# Altium schematic sheet [06] - MICRO CONTROLLER CONNECTORS.SchDoc (part 2 of 2)
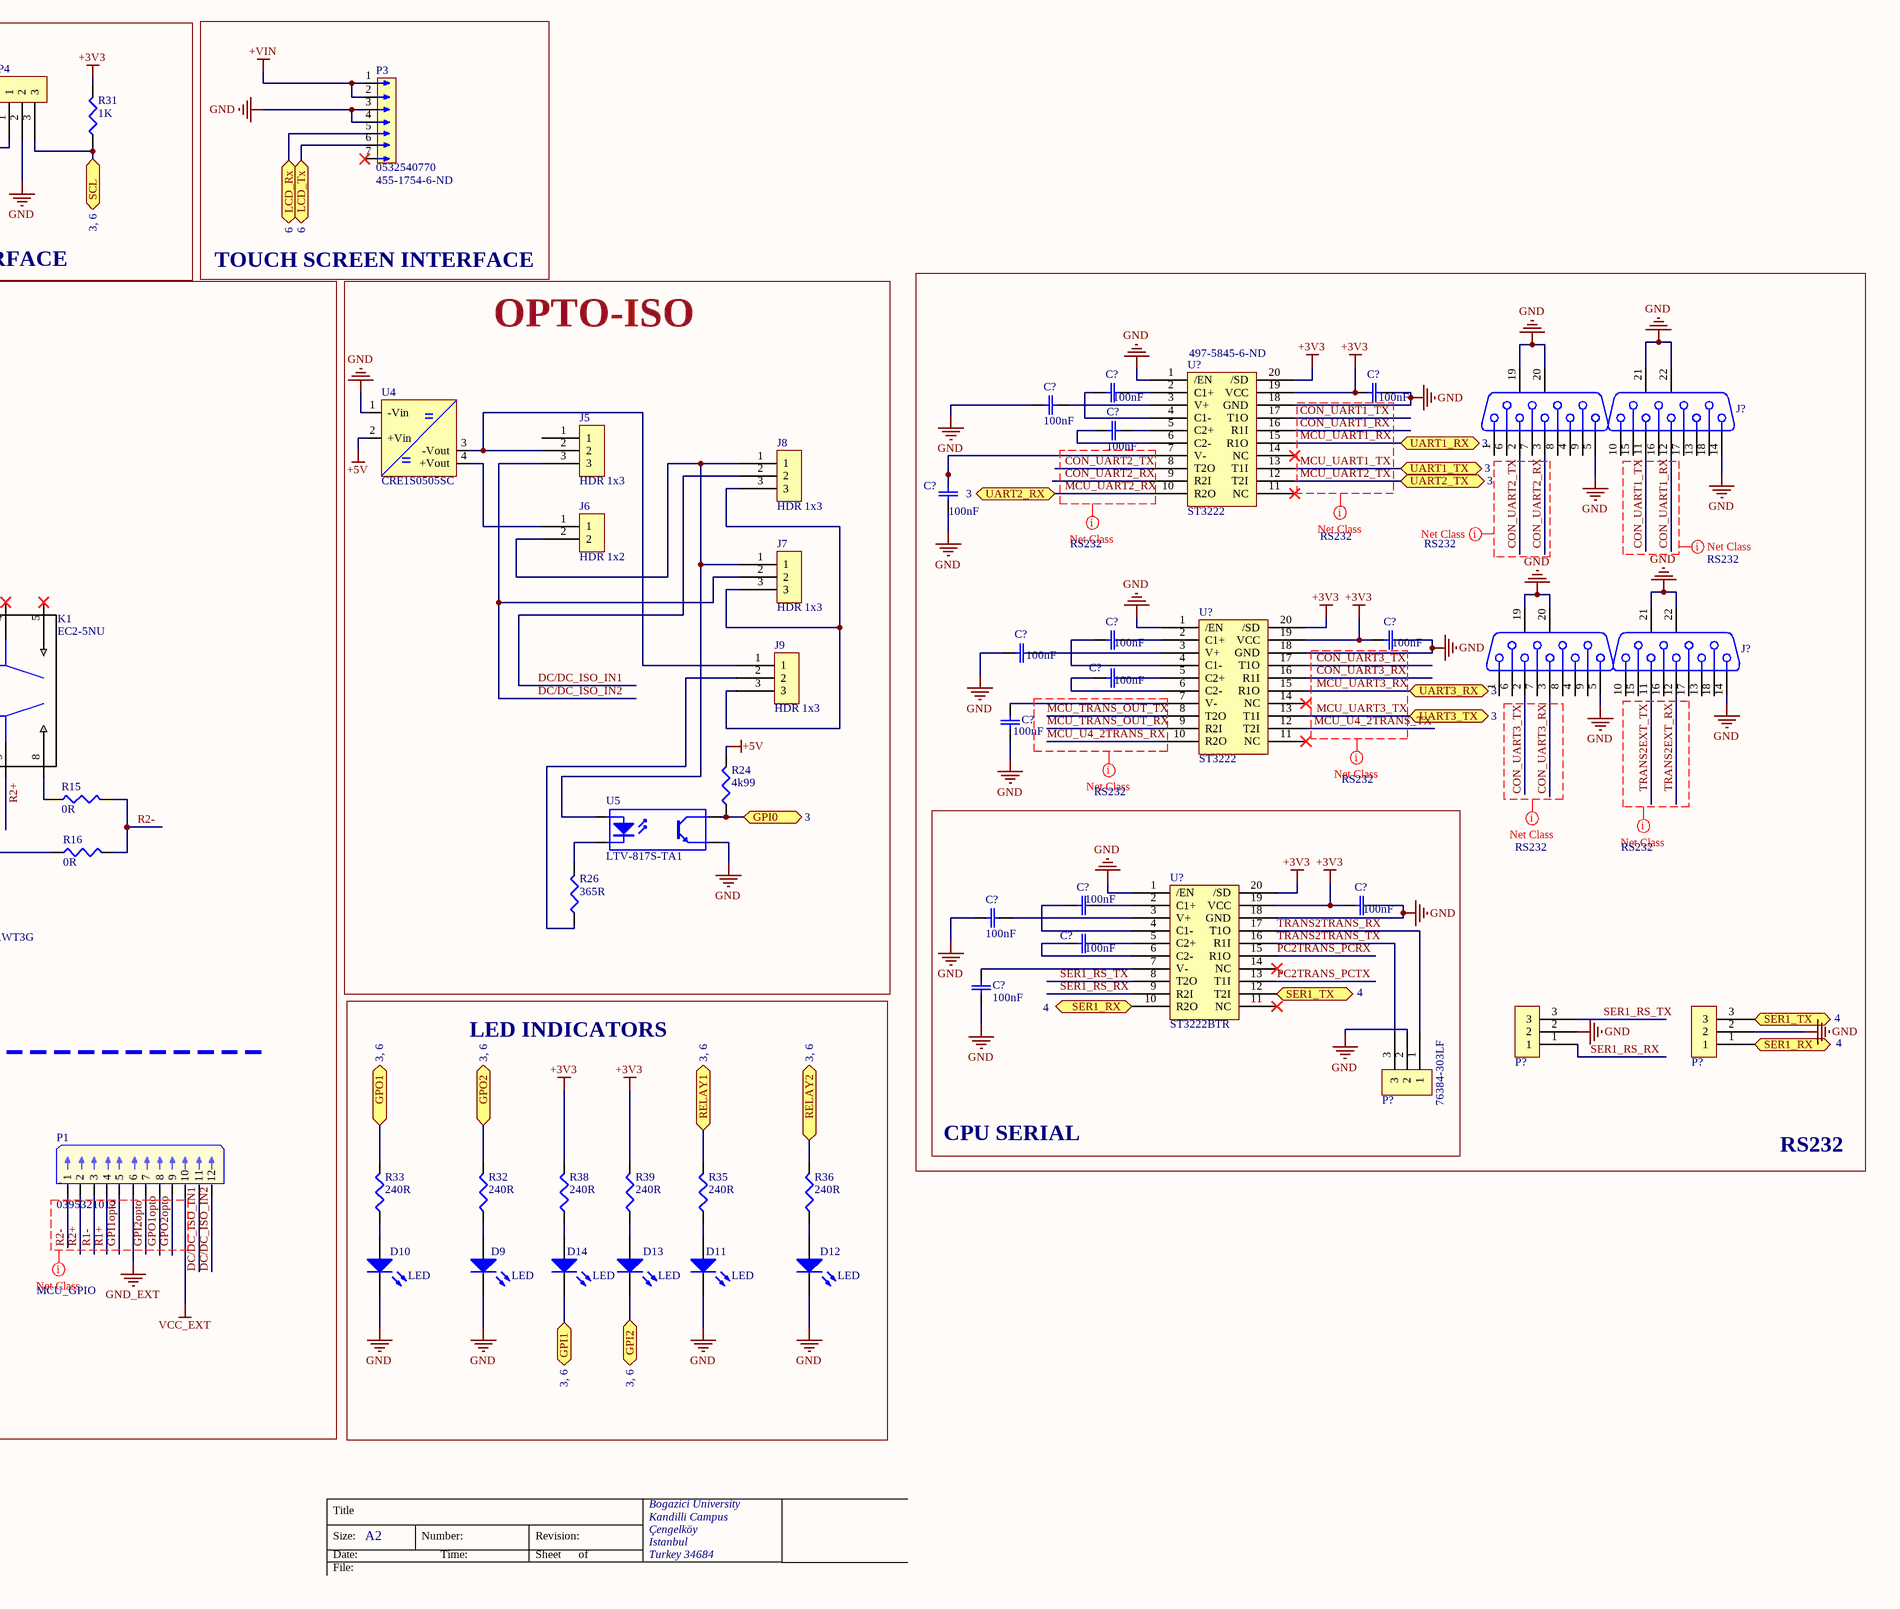
[diagram p4: [06] - MICRO CONTROLLER CONNECTORS.SchDoc, bottom right]

## Library data of the parts
C1 C5 C?#1-C?#4 = CL05A104KA5NNNC: CAP CER 0.1UF 50V X8R 0603; Manufacturer 1: Samsung Electro-Mechanics; Tolerance: ±10%; Voltage - Rated: 25V; Temperature Coefficient: X5R; Notification: Current market demand for these product types have resulted in fluctuating and extending lead times. Lead times may differ.; Description 1: CAP CER 0.1UF 25V X5R 0402; Manufacturer Part Number 1: CL05A104KA5NNNC; RoHS: RoHS Compliant; Stock 1: 100000; Pricing 1: 1=0.1, 10=0.04, 100=0.0176, 500=0.0126, 1000=0.0099, 2500=0.009, 5000=0.00828 (USD); Packaging: Digi-Reel®; Part Status: Active; Operating Temperature: -55°C ~ 85°C; Features: -; Ratings: -; Applications: General Purpose; Mounting Type: Surface Mount, MLCC; Package / Case: 0402 (1005 Metric); Size / Dimension: 0.039" L x 0.020" W (1.00mm x 0.50mm); Height - Seated (Max): -; Thickness (Max): 0.022" (0.55mm); Lead Spacing: -; Lead Style: -; Supplier 1: Digi-Key; Supplier Part Number 1: 1276-1043-6-ND; Category: Capacitors; ComponentLink1URL: http://www.samsungsem.com/kr/support/product-search/mlcc/CL05A104KA5NNNC.jsp; ComponentLink1Description: http://www.samsungsem.com/kr/support/product-search/mlcc/CL05A104KA5NNNC.jsp
C57 C66 C?#5-C?#15 = CL05A104KA5NNNC: CAP CER 0.1UF 50V X8R 0603; Manufacturer 1: Samsung Electro-Mechanics; Voltage - Rated: 25V; Tolerance: ±10%; Temperature Coefficient: X5R; Notification: Current market demand for these product types have resulted in fluctuating and extending lead times. Lead times may differ.; Description 1: CAP CER 0.1UF 25V X5R 0402; Category: Capacitors; Operating Temperature: -55°C ~ 85°C; Package / Case: 0402 (1005 Metric); Supplier 1: Digi-Key; Supplier Part Number 1: 1276-1043-6-ND; RoHS: RoHS Compliant; Stock 1: 100000; Pricing 1: 1=0.1, 10=0.04, 100=0.0176, 500=0.0126, 1000=0.0099, 2500=0.009, 5000=0.00828 (USD); Mounting Type: Surface Mount, MLCC; Applications: General Purpose; Ratings: -; Size / Dimension: 0.039" L x 0.020" W (1.00mm x 0.50mm); Height - Seated (Max): -; Thickness (Max): 0.022" (0.55mm); Lead Spacing: -; Features: -; Packaging: Digi-Reel®; Lead Style: -; ComponentLink1URL: http://www.samsungsem.com/kr/support/product-search/mlcc/CL05A104KA5NNNC.jsp; ComponentLink1Description: http://www.samsungsem.com/kr/support/product-search/mlcc/CL05A104KA5NNNC.jsp; Manufacturer Part Number 1: CL05A104KA5NNNC; Part Status: Active
C63 = CGA5L3X8R1H105K1: CAP CER 1UF 50V X8R 1206; Manufacturer_Part_Number: CGA5L3X8R1H105K160AB; Manufacturer 1: TDK Corporation; Vendor: TDK; Built_By: EMA_UL_Team; Type: DEV; C: Copyright (C) 2015 Accelerated Designs. All rights reserved; Tolerance: ±10%; RefDes: RefDes; Value: Value; Manufacturer Part Number 1: CGA5L3X8R1H105K160AB; RoHS: RoHS Compliant; Stock 1: 3285; Pricing 1: 1=0.85, 10=0.628, 100=0.4306, 500=0.34086, 1000=0.28704 (USD); Packaging: Cut Tape (CT); Part Status: Active; Voltage - Rated: 50V; Temperature Coefficient: X8R; Operating Temperature: -55°C ~ 150°C; Features: High Temperature; Ratings: AEC-Q200; Applications: Automotive; Failure Rate: -; Mounting Type: Surface Mount, MLCC; Package / Case: 1206 (3216 Metric); Size / Dimension: 0.126" L x 0.063" W (3.20mm x 1.60mm); Height - Seated (Max): -; Thickness (Max): 0.071" (1.80mm); Lead Spacing: -; Lead Style: -; ComponentLink1URL: https://product.tdk.com/info/en/catalog/datasheets/mlcc_automotive_hightemp_en.pdf; ComponentLink1Description: https://product.tdk.com/info/en/catalog/datasheets/mlcc_automotive_hightemp_en.pdf; Supplier 1: Digi-Key; Supplier Part Number 1: 445-13000-1-ND; Description 1: CAP CER 1UF 50V X8R 1206; Category: Capacitors
D3 D4 D28 = CDSOT23: TVS DIODE 24V 40V SOT23; Manufacturer 1: Bourns Inc.; Manufacturer Part Number 1: CDSOT23-T24CAN; Type: Zener; Voltage - Breakdown (Min): 26.2V; Current - Peak Pulse (10/1000µs): 8A (8/20µs); Power Line Protection: No; Capacitance @ Frequency: 22pF @ 1MHz; RoHS: RoHS Compliant; Stock 1: 26793; Pricing 1: 1=0.57, 10=0.399, 25=0.3272, 100=0.2617, 250=0.19036, 500=0.15466, 1000=0.11897 (USD); Packaging: Cut Tape (CT); Part Status: Active; Voltage - Reverse Standoff (Typ): 24V; Voltage - Clamping (Max) @ Ipp: 40V; Power - Peak Pulse: -; Applications: CAN; Operating Temperature: -40°C ~ 150°C (TJ); Mounting Type: Surface Mount; Package / Case: TO-236-3, SC-59, SOT-23-3; Supplier Device Package: SOT-23; ComponentLink1URL: https://www.bourns.com/docs/Product-Datasheets/CDSOT23-T24CAN.pdf; ComponentLink1Description: https://www.bourns.com/docs/Product-Datasheets/CDSOT23-T24CAN.pdf; Supplier 1: Digi-Key; Supplier Part Number 1: CDSOT23-T24CANCT-ND; Description 1: TVS DIODE 24V 40V SOT23; Category: Circuit Protection
D6 D7 = 1N4148: DIODE GEN PURP 100V 150MA SOD123; Manufacturer 1: Micro Commercial Co; Manufacturer Part Number 1: 1N4148W-TP; Vendor: Nexperia; Type: DEV; C: Copyright (C) 2015 Accelerated Designs. All rights reserved; .Checked PCB: CHK; Diode Type: Standard; Speed: Small Signal =< 200mA (Io), Any Speed; Capacitance @ Vr, F: 2pF @ 0V, 1MHz; Manufacturer_Part_Number: 1N4148; Copyright: Copyright (C) 2016 Accelerated Designs. All rights reserved; RefDes: RefDes; Value: Value; .Checked SCH: CHK; Supplier 1: Digi-Key; Supplier Part Number 1: 1N4148WTPMSCT-ND; RoHS: RoHS Compliant; Description 1: DIODE GEN PURP 100V 150MA SOD123; Category: Discrete Semiconductor Products; Stock 1: 1984430; Pricing 1: 1=0.14, 10=0.131, 100=0.0856, 500=0.04186, 1000=0.02854 (USD); Packaging: Cut Tape (CT); Part Status: Active; Current - Average Rectified (Io): 150mA; Mounting Type: Surface Mount; Package / Case: SOD-123; Supplier Device Package: SOD-123; Operating Temperature - Junction: -65°C ~ 150°C; Base Part Number: 1N4148W; ComponentLink1URL: http://www.mccsemi.com/up_pdf/1N4148W(SOD123).pdf; ComponentLink1Description: http://www.mccsemi.com/up_pdf/1N4148W(SOD123).pdf
D9-D12 D14 = LW Q38E-Q1OO-3K6L-1: LED COOL WHITE DIFFUSED 0603 SMD; Manufacturer 1: OSRAM Opto Semiconductors Inc.; Color: White, Cool; Lens Color: Yellow; Millicandela Rating: 81mcd; Lens Style/Size: Rectangle with Flat Top, 1.10mm x 0.80mm; Voltage - Forward (Vf) (Typ): 2.85V; Current - Test: 5mA; Viewing Angle: 150°, 130°; Wavelength - Dominant: 8200K; Supplier 1: Digi-Key; Supplier Part Number 1: 475-2831-1-ND; Manufacturer Part Number 1: LW Q38E-Q1OO-3K6L-1; RoHS: RoHS Compliant; Description 1: LED COOL WHITE DIFFUSED 0603 SMD; Category: Optoelectronics; Stock 1: 215520; Pricing 1: 1=0.49, 10=0.354, 25=0.2888, 100=0.231, 250=0.19492, 500=0.16604, 1000=0.12994 (USD); Packaging: Cut Tape (CT); Part Status: Active; Lens Transparency: Diffused; Mounting Type: Surface Mount; Wavelength - Peak: -; Features: -; Package / Case: 0603 (1608 Metric); Supplier Device Package: 0603; Size / Dimension: 1.60mm L x 0.80mm W; Height (Max): 0.40mm; ComponentLink1URL: https://dammedia.osram.info/media/resource/hires/osram-dam-2493068/LW%20Q38E.pdf; ComponentLink1Description: https://dammedia.osram.info/media/resource/hires/osram-dam-2493068/LW%20Q38E.pdf
D13 = LS Q976-NR-1: LED RED DIFFUSED 0603 SMD; Manufacturer 1: OSRAM Opto Semiconductors Inc.; Lens Color: White; Millicandela Rating: 104mcd; Lens Style/Size: Rectangle with Flat Top, 1.00mm x 0.80mm; Voltage - Forward (Vf) (Typ): 2V; Current - Test: 20mA; Viewing Angle: 160°; Wavelength - Dominant: 633nm; Wavelength - Peak: 645nm; Supplier 1: Digi-Key; Supplier Part Number 1: 475-2512-1-ND; Manufacturer Part Number 1: LS Q976-NR-1; RoHS: RoHS Compliant; Description 1: LED RED DIFFUSED 0603 SMD; Category: Optoelectronics; Stock 1: 127302; Pricing 1: 1=0.38, 10=0.274, 25=0.202, 100=0.1444, 250=0.0982, 500=0.08664, 1000=0.06787 (USD); Packaging: Cut Tape (CT); Part Status: Active; Color: Red; Lens Transparency: Diffused; Mounting Type: Surface Mount; Features: -; Package / Case: 0603 (1608 Metric); Supplier Device Package: 0603; Size / Dimension: 1.60mm L x 0.80mm W; Height (Max): 0.80mm; ComponentLink1URL: https://dammedia.osram.info/media/resource/hires/osram-dam-2493499/LS%20Q976.pdf; ComponentLink1Description: https://dammedia.osram.info/media/resource/hires/osram-dam-2493499/LS%20Q976.pdf; Published: 8-Jun-2000; LatestRevisionDate: 08-Jul-2005; LatestRevisionNote: Mech Layer 1 removed.; PackageReference: LED-0; Publisher: Altium Limited; PackageDescription: LED; 2 Leads
D27 = BAT43WS-7-F: DIODE SCHOTTKY 30V 200MA SOD323; Manufacturer 1: Diodes Incorporated; Current - Average Rectified (Io): 200mA (DC); Speed: Small Signal =< 200mA (Io), Any Speed; Capacitance @ Vr, F: 10pF @ 1V, 1MHz; Manufacturer Part Number 1: BAT43WS-7-F; RoHS: RoHS Compliant; Stock 1: 45041; Pricing 1: 1=0.47, 10=0.352, 100=0.2028, 500=0.13698, 1000=0.10685 (USD); Packaging: Cut Tape (CT); Part Status: Active; Diode Type: Schottky; Mounting Type: Surface Mount; Package / Case: SC-76, SOD-323; Supplier Device Package: SOD-323; Operating Temperature - Junction: -55°C ~ 125°C; Base Part Number: BAT43WS; ComponentLink1URL: https://www.diodes.com/assets/Datasheets/ds30100.pdf; ComponentLink1Description: https://www.diodes.com/assets/Datasheets/ds30100.pdf; Supplier 1: Digi-Key; Supplier Part Number 1: BAT43WS-FDICT-ND; Description 1: DIODE SCHOTTKY 30V 200MA SOD323; Category: Discrete Semiconductor Products
J2 = 796644-3: TERM BLOCK HDR 3POS 90DEG 5MM; Manufacturer 1: TE Connectivity AMP Connectors; Vendor: TE Connectivity; Built_By: EMA_UL_Team; C: Copyright (C) 2015 Accelerated Designs. All rights reserved; Number of Positions: 3; Number of Levels: 1; Pitch: 0.197" (5.00mm); Header Orientation: 90°, Right Angle; Material Flammability Rating: UL94 V-0; Contact Tail Length: 0.138" (3.50mm); .Checked PCB: CHK; Manufacturer_Part_Number: 796644-3; RefDes: RefDes; Type: DEV; Value: Value; Manufacturer Part Number 1: 796644-3; RoHS: RoHS Compliant; Stock 1: 93322; Pricing 1: 1=1.05, 10=0.734, 25=0.6848, 50=0.6218, 100=0.619, 250=0.52268, 500=0.49516, 1000=0.44014, 5000=0.35762 (USD); Packaging: Bulk; Part Status: Active; Positions Per Level: 3; Plug Wire Entry: -; Termination Style: Solder; Mounting Type: Through Hole; Current - IEC: -; Wire Gauge or Range - AWG: -; Wire Gauge or Range - mm²: -; Color: Green; Operating Temperature: -40°C ~ 110°C; Contact Mating Finish: Tin; Features: -; Ingress Protection: -; Screw Size: -; Torque - Screw: -; Wire Strip Length: -; Contact Material: Copper Alloy; Housing Material: Polyamide (PA66), Nylon 6/6; Insulation Height: 0.329" (8.36mm); ComponentLink1URL: http://www.te.com/commerce/DocumentDelivery/DDEController?Action=srchrtrv&DocNm=796644&DocType=Customer+Drawing&DocLang=English; ComponentLink1Description: http://www.te.com/commerce/DocumentDelivery/DDEController?Action=srchrtrv&DocNm=796644&DocType=Customer+Drawing&DocLang=English; Supplier 1: Digi-Key; Supplier Part Number 1: A98249-ND; Description 1: TERM BLOCK HDR 3POS 90DEG 5MM; Category: Connectors, Interconnects; .Checked SCH: CHK
J5 = 68000-103HLF: BERGSTIK II .100" SR STRAIGHT; Manufacturer: FCI; Connector Type: Header, Unshrouded; Number of Positions: 3; Number of Positions Loaded: All; Pitch: 0.100" (2.54mm); .Checked PCB: MM; Supplier 1: Digi-Key; Supplier Part Number 1: 609-3461-ND; Manufacturer Part Number: 68000-103HLF; RoHS: RoHS Compliant; Category: Connectors, Interconnects; Stock 1: 37214; Pricing 1: 1=0.15, 10=0.145, 25=0.108, 50=0.0924 (USD); Contact Type: Male Pin; Number of Rows: 1; Row Spacing: -; Contact Mating Length: 0.230" (5.84mm); Mounting Type: Through Hole; Termination: Solder; Fastening Type: -; Features: -; Contact Finish: Gold or Gold, GXT™; Contact Finish Thickness: 30µin (0.76µm); Color: Black; Packaging: Bulk; ComponentLink1URL: http://portal.fciconnect.com/Comergent//fci/drawing/68000.pdf; ComponentLink1Description: http://portal.fciconnect.com/Comergent//fci/drawing/68000.pdf; .Checked SCH: MM; .Creator: MM
J6 J?#1-J?#14 = 68001-202HLF: BERGSTIK II .100" SR STRAIGHT; Manufacturer: FCI; Connector Type: Header, Unshrouded; Number of Positions: 2; Number of Positions Loaded: All; Pitch: 0.100" (2.54mm); .Checked PCB: CHK; Supplier 1: Digi-Key; Supplier Part Number 1: 609-3469-ND; Manufacturer Part Number: 68001-202HLF; RoHS: RoHS Compliant; Category: Connectors, Interconnects; Stock 1: 13680; Pricing 1: 1=0.45, 10=0.265, 100=0.1172, 250=0.09828, 500=0.09072, 1000=0.07938, 5000=0.05065 (USD); Contact Type: Male Pin; Number of Rows: 1; Row Spacing: -; Contact Mating Length: 0.230" (5.84mm); Mounting Type: Through Hole; Termination: Solder; Fastening Type: -; Features: -; Contact Finish: Gold; Contact Finish Thickness: 15µin (0.38µm); Color: Black; Packaging: Bulk; ComponentLink1URL: http://portal.fciconnect.com/res/en/pdffiles/doc_search/68000.pdf; ComponentLink1Description: http://portal.fciconnect.com/res/en/pdffiles/doc_search/68000.pdf; .Checked SCH: CHK
J7-J9 = 68000-103HLF: BERGSTIK II .100" SR STRAIGHT; Manufacturer: FCI; Connector Type: Header, Unshrouded; Number of Positions: 3; Number of Positions Loaded: All; Pitch: 0.100" (2.54mm); .Creator: MM; .Checked PCB: CHK; Supplier 1: Digi-Key; Manufacturer Part Number: 68000-103HLF; RoHS: RoHS Compliant; Category: Connectors, Interconnects; Stock 1: 37214; Pricing 1: 1=0.15, 10=0.145, 25=0.108, 50=0.0924 (USD); Packaging: Bulk; Contact Type: Male Pin; Number of Rows: 1; Row Spacing: -; Contact Mating Length: 0.230" (5.84mm); Mounting Type: Through Hole; Termination: Solder; Fastening Type: -; Features: -; Contact Finish: Gold or Gold, GXT™; Contact Finish Thickness: 30µin (0.76µm); Color: Black; ComponentLink1URL: http://portal.fciconnect.com/Comergent//fci/drawing/68000.pdf; ComponentLink1Description: http://portal.fciconnect.com/Comergent//fci/drawing/68000.pdf; Supplier Part Number 1: 609-3461-ND; .Checked SCH: CHK
J21 = 292304-1: 1 Port Right Angle Through Hole Mount Female Type B USB Connector, 4 Position, -55 to 85 degC, RoHS, Tray; Gender: Receptacle; USB Standard: USB 2.0; No. of Positions: 4; SVHC: To Be Advised; .Checked PCB: CHK; PackageReference: THD; PackageDescription: THD, 4-Leads, Body 15.71x12.04mm, Pitch 2.5mm; Supplier 1: Digi-Key; Supplier Part Number 1: A31725-ND; Connector Mounting: Through Hole; Orientation: Right Angle; USB Connector Type: USB Type B; Series: B; Contact Plating: Gold; Contact Material: Copper Alloy; Mounting Technology: Through Hole; ComponentLink1Description: Manufacturer URL; ComponentLink1URL: http://www.te.com; ComponentLink2Description: Datasheet; ComponentLink2URL: https://datasheet.ciiva.com/851/eng-cd-292304-d2-851088.pdf; .Checked SCH: CHK
J?#15 J?#16 = DSUB-9 Stack: 189-009-613R491; Manufacturer 1: NorComp Inc.; PackageDocument: O; Positions: 9; Gender: Receptacle; Connector Style: D-Sub - Stacked; Connector Type: Plug, Male Pins; Number of Positions: 9, 9; Flange Feature: Housing/Shell (4-40); Material Flammability Rating: UL94 V-0; Current Rating: 5A; Contact Form: Stamped; Backset Spacing: 0.318" (8.08mm); Description 1: CONN D-SUB PLUG 9POS R/A SLDR; .Checked PCB: CHK; Published: 15-Jun-2001; LatestRevisionDate: 17-Jul-2002; LatestRevisionNote: Re-released for DXP Platform.; DatasheetDocument: 1-Sep-1999; PackageReference: 788750; Publisher: Altium Limited; Orientation: Right Angle; Manufacturer Part Number 1: 189-009-613R491; RoHS: RoHS Compliant; Stock 1: 1768; Pricing 1: 1=6.96, 10=6.67, 25=6.09, 50=5.8, 100=5.51, 250=4.93, 500=4.64, 1000=4.06, 2500=3.857 (USD); Packaging: Tray; Part Status: Active; Number of Rows: 2, 2; Shell Size, Connector Layout: 1 (DE, E); 1 (DE, E); Contact Type: Signal; Mounting Type: Panel Mount, Through Hole, Right Angle; Termination: Solder; Features: Board Lock, Grounding Indents, Shielded; Shell Material, Finish: Steel, Nickel Plated; Contact Finish: Gold; Contact Finish Thickness: Flash; Ingress Protection: -; Operating Temperature: -55°C ~ 105°C; Voltage Rating: -; Color: Black; Housing Material: Polyamide (PA9T), Nylon 9T; Wire Gauge: -; Contact Material: Brass; ComponentLink1URL: https://www.norcomp.net/rohspdfs/Connectors/18Y/189/613/189-YYY-613R491.pdf; ComponentLink1Description: https://www.norcomp.net/rohspdfs/Connectors/18Y/189/613/189-YYY-613R491.pdf; Supplier 1: Digi-Key; Supplier Part Number 1: 189-409MME-ND; Category: Connectors, Interconnects; .Checked SCH: CHK
K1 K2 = EC2-5NU: RELAY GEN PURPOSE DPDT 2A 5V; Vendor: KEMET; Built_By: EMA_UL_Team; C: Copyright (C) 2015 Accelerated Designs. All rights reserved; Relay Type: General Purpose; Coil Type: Non Latching; Coil Voltage: 5VDC; Contact Form: DPDT (2 Form C); Switching Voltage: 250VAC, 220VDC - Max; Turn On Voltage (Max): 3.75 VDC; Turn Off Voltage (Min): 0.5 VDC; Coil Power: 140 mW; .Checked PCB: CHK; Manufacturer_Part_Number: EC2-5NU; RefDes: RefDes; Type: DEV; Value: Value; Manufacturer 1: KEMET; Manufacturer Part Number 1: EC2-5NU; RoHS: RoHS Compliant; Stock 1: 14823; Pricing 1: 1=1.63, 10=1.53, 25=1.36, 50=1.292, 100=1.224, 250=1.088, 500=1.02, 1000=0.952, 5000=0.918 (USD); Packaging: Tube; Part Status: Active; Features: -; Mounting Type: Through Hole; Termination Style: PC Pin; Operating Temperature: -40°C ~ 85°C; Contact Material: Silver Alloy, Gold Alloy; ComponentLink1URL: https://api.kemet.com/component-edge/download/datasheet/EC2-5NU.pdf; ComponentLink1Description: https://api.kemet.com/component-edge/download/datasheet/EC2-5NU.pdf; Supplier 1: Digi-Key; Supplier Part Number 1: 399-11052-5-ND; Description 1: RELAY GEN PURPOSE DPDT 2A 5V; Category: Relays; .Checked SCH: CHK
L7 = ACM2012-900-2P-T002: CHOKE COMM MODE 90 OHM .4A SMD; Manufacturer: TDK Corporation; Filter Type: Data, Signal Line; Number of Lines: 2; Current: 400mA; DC Resistance (DCR): 190 mOhm Max; Impedance: 90 Ohm; Resistance (Ohms): 8.2K; Power (Watts): 0.063W, 1/16W; Temperature Coefficient: ±100ppm/°C; Tolerance: ±1%; .Checked PCB: CHK; Supplier 1: Digi-Key; Supplier Part Number 1: 445-2207-1-ND; Manufacturer Part Number: ACM2012-900-2P-T002; RoHS: RoHS Compliant; Category: Filters; Stock 1: 175768; Pricing 1: 1=0.48, 10=0.448, 50=0.42, 100=0.364, 500=0.308, 1000=0.252 (USD); Inductance: -; Mounting Type: Surface Mount; Size / Dimension: 0.079" L x 0.047" W (2.00mm x 1.20mm); Height (Max): 0.051" (1.30mm); Package / Case: 0805 (2012 Metric), 4 Lead; Operating Temperature: -25°C ~ 85°C; Packaging: Cut Tape (CT); ComponentLink1URL: http://www.tdk.co.jp/tefe02/e9719_acm2012.pdf; ComponentLink1Description: http://www.tdk.co.jp/tefe02/e9719_acm2012.pdf; Composition: Thick Film; Features: -; Height: 0.016" (0.40mm); Number of Terminations: 2; ComponentLink2URL: http://www.yageo.com/documents/recent/PYu-RC0402_51_RoHS_L_6.pdf; ComponentLink2Description: http://www.yageo.com/documents/recent/PYu-RC0402_51_RoHS_L_6.pdf; .Checked SCH: CHK
LS1 = GT-0903A: AUDIO MAGNETIC XDCR 2-4V TH; Manufacturer 1: Soberton Inc.; Driver Circuitry: Transducer, Externally Driven; Input Type: Zero-Peak Signal; Voltage Range: 2 ~ 4V; Frequency: 2.73kHz; Operating Mode: Single Tone; Sound Pressure Level (SPL): 85dB @ 3V, 10cm; Current - Supply: 80mA; Port Location: Top; Supplier 1: Digi-Key; Supplier Part Number 1: 433-1032-ND; Manufacturer Part Number 1: GT-0903A; RoHS: RoHS Compliant; Description 1: AUDIO MAGNETIC XDCR 2-4V TH; Category: Audio Products; Stock 1: 13944; Pricing 1: 1=0.97, 10=0.774, 25=0.7036, 50=0.658, 100=0.6125, 250=0.56, 500=0.5215, 1000=0.4865, 5000=0.4375 (USD); Packaging: Tray; Part Status: Active; Technology: Magnetic; Duration: -; Operating Temperature: -20°C ~ 60°C; Approvals: -; Ratings: -; Mounting Type: Through Hole; Termination: PC Pins; Size / Dimension: 0.354" Dia (9.00mm); Height - Seated (Max): 0.197" (5.00mm); ComponentLink1URL: http://cirlw3yrzg4afc1x47lv2k18.wpengine.netdna-cdn.com/wp-content/uploads/2016/10/GT-0903A-Rev.A_2016-1.pdf; ComponentLink1Description: http://cirlw3yrzg4afc1x47lv2k18.wpengine.netdna-cdn.com/wp-content/uploads/2016/10/GT-0903A-Rev.A_2016-1.pdf
P1 = 0395321012: TERM BLOCK HDR 12POS 5.08MM; Manufacturer 1: Molex, LLC; Number of Positions: 12; Number of Levels: 1; Pitch: 0.200" (5.08mm); Header Orientation: 90°, Right Angle; Material Flammability Rating: UL94 V-0; Contact Tail Length: 0.150" (3.81mm); Manufacturer Part Number 1: 0395321012; RoHS: RoHS Compliant; Stock 1: 207; Pricing 1: 1=3.15, 10=3.02, 100=2.5164, 500=2.1389, 1000=1.82436, 5000=1.63563 (USD); Packaging: Bulk; Part Status: Active; Type: Header, Male Pins, Shrouded (4 Side); Positions Per Level: 12; Plug Wire Entry: -; Termination Style: Solder; Mounting Type: Through Hole; Current - IEC: -; Wire Gauge or Range - AWG: -; Wire Gauge or Range - mm²: -; Color: Black; Operating Temperature: -40°C ~ 105°C; Contact Mating Finish: Tin; Features: -; Ingress Protection: -; Screw Size: -; Torque - Screw: -; Wire Strip Length: -; Contact Material: Brass; Housing Material: Polyamide (PA66), Nylon 6/6; Insulation Height: 0.472" (12.00mm); ComponentLink1URL: https://www.molex.com/pdm_docs/sd/395321002_sd.pdf; ComponentLink1Description: https://www.molex.com/pdm_docs/sd/395321002_sd.pdf; Supplier 1: Digi-Key; Supplier Part Number 1: WM7852-ND; Description 1: TERM BLOCK HDR 12POS 5.08MM; Category: Connectors, Interconnects
P2 = 691313710005: TERM BLOCK HDR 5POS 90DEG 5MM; Manufacturer 1: Wurth Electronics Inc.; Number of Positions: 5; Number of Levels: 1; Pitch: 0.197" (5.00mm); Header Orientation: 90°, Right Angle; Material Flammability Rating: UL94 V-0; Contact Tail Length: 0.157" (4.00mm); .Checked SCH: CHK; Manufacturer Part Number 1: 691313710005; RoHS: RoHS Compliant; Stock 1: 141; Pricing 1: 1=1.25, 10=1.1, 50=0.95, 100=0.85, 330=0.8, 660=0.75 (USD); Packaging: Bulk; Part Status: Active; Type: Header, Male Pins, Shrouded (4 Side); Positions Per Level: 5; Plug Wire Entry: -; Termination Style: Solder; Mounting Type: Through Hole; Current - IEC: -; Wire Gauge or Range - AWG: -; Wire Gauge or Range - mm²: -; Color: Green; Operating Temperature: -40°C ~ 105°C; Contact Mating Finish: Tin; Features: -; Ingress Protection: -; Screw Size: -; Torque - Screw: -; Wire Strip Length: -; Contact Material: Brass; Housing Material: Polybutylene Terephthalate (PBT); Insulation Height: 0.335" (8.51mm); ComponentLink1URL: http://katalog.we-online.de/em/datasheet/6913137100xx.pdf; ComponentLink1Description: http://katalog.we-online.de/em/datasheet/6913137100xx.pdf; Supplier 1: Digi-Key; Supplier Part Number 1: 732-2802-ND; Description 1: TERM BLOCK HDR 5POS 90DEG 5MM; Category: Connectors, Interconnects; .Checked PCB: CHK
P3 = 0532540770: HEADER 2MM WTB R/A SQ PIN 7CKT; Manufacturer 1: JST Sales America Inc.; Manufacturer Part Number 1: S7B-PH-SM4-TB(LF)(SN); Pitch - Mating: 0.079" (2.00mm); Number of Positions: 7; Number of Positions Loaded: All; Style: Board to Cable/Wire; Shrouding: Shrouded - 4 Wall; Contact Length - Mating: 0.130" (3.30mm); Material Flammability Rating: UL94 V-0; Current Rating: 2A; Voltage Rating: 100V; Description 1: CONN HEADER PH SIDE 7POS 2MM SMD; Supplier 1: Digi-Key; RoHS: RoHS Compliant; Category: Connectors, Interconnects; Stock 1: 83702; Pricing 1: 1=0.91, 10=0.798, 100=0.6882, 500=0.56304 (USD); Packaging: Digi-Reel®; Part Status: Active; Connector Type: Header; Contact Type: Male Pin; Number of Rows: 1; Row Spacing - Mating: -; Mounting Type: Surface Mount, Right Angle; Termination: Solder; Fastening Type: Detent Lock; Contact Length - Post: -; Overall Contact Length: -; Insulation Height: 0.217" (5.51mm); Contact Shape: Square; Contact Finish - Mating: Tin; Contact Finish Thickness - Mating: -; Contact Finish - Post: Tin; Contact Material: Copper Alloy; Insulation Material: Polyamide (PA6T), Nylon 6T; Features: Solder Retention; Operating Temperature: -25°C ~ 85°C; Ingress Protection: -; Insulation Color: Natural; Mated Stacking Heights: -; Contact Finish Thickness - Post: -; Applications: -; ComponentLink1URL: http://www.jst-mfg.com/product/pdf/eng/ePH.pdf; ComponentLink1Description: http://www.jst-mfg.com/product/pdf/eng/ePH.pdf
P4 P?#1-P?#4 = 76384-303LF: CONN HEADER 3POS .100" STR GOLD; Manufacturer: FCI; Connector Type: Header, Shrouded; Number of Positions: 3; Number of Positions Loaded: All; Pitch: 0.100" (2.54mm); .Creator: MM; .Checked PCB: CHK; Supplier 1: Digi-Key; Manufacturer Part Number: 76384-303LF; RoHS: RoHS Compliant; Category: Connectors, Interconnects; Stock 1: 1441; Pricing 1: 1=0.59, 10=0.556, 25=0.5, 50=0.4444, 100=0.426, 250=0.38892, 500=0.3704, 1000=0.30558, 2500=0.2778 (USD); Packaging: Tube; Contact Type: Male Pin; Number of Rows: 1; Row Spacing: -; Contact Mating Length: 0.197" (5.00mm); Mounting Type: Through Hole; Termination: Solder; Fastening Type: Friction Lock; Features: -; Contact Finish: Gold, GXT™; Contact Finish Thickness: 30µin (0.76µm); Color: Black; ComponentLink1URL: http://portal.fciconnect.com/Comergent//fci/drawing/76384.pdf; ComponentLink1Description: http://portal.fciconnect.com/Comergent//fci/drawing/76384.pdf; Supplier Part Number 1: 609-1305-ND; .Checked SCH: CHK
P?#5 = 76384-303LF: CONN HEADER 3POS .100" STR GOLD; Manufacturer: FCI; Connector Type: Header, Shrouded; Number of Positions: 3; Number of Positions Loaded: All; Pitch: 0.100" (2.54mm); .Creator: MM; Supplier 1: Digi-Key; Manufacturer Part Number: 76384-303LF; RoHS: RoHS Compliant; Category: Connectors, Interconnects; Stock 1: 1441; Pricing 1: 1=0.59, 10=0.556, 25=0.5, 50=0.4444, 100=0.426, 250=0.38892, 500=0.3704, 1000=0.30558, 2500=0.2778 (USD); Packaging: Tube; Contact Type: Male Pin; Number of Rows: 1; Row Spacing: -; Contact Mating Length: 0.197" (5.00mm); Mounting Type: Through Hole; Termination: Solder; Fastening Type: Friction Lock; Features: -; Contact Finish: Gold, GXT™; Contact Finish Thickness: 30µin (0.76µm); Color: Black; ComponentLink1URL: http://portal.fciconnect.com/Comergent//fci/drawing/76384.pdf; ComponentLink1Description: http://portal.fciconnect.com/Comergent//fci/drawing/76384.pdf; Supplier Part Number 1: 609-1305-ND; .Checked PCB: MM; .Checked SCH: MM
Q1 Q2 = MMBT2222AWT3G: TRANS NPN 40V 0.6A SC70-3; Manufacturer 1: ON Semiconductor; Vce Saturation (Max) @ Ib, Ic: 1V @ 50mA, 500mA; DC Current Gain (hFE) (Min) @ Ic, Vce: 100 @ 150mA, 10V; Frequency - Transition: 300MHz; ComponentLink1Description: http://www.onsemi.com/pub/Collateral/MMBT2222AWT1-D.PDF; ComponentLink1URL: http://www.onsemi.com/pub/Collateral/MMBT2222AWT1-D.PDF; Supplier 1: Digi-Key; Supplier Part Number 1: MMBT2222AWT3GOSDKR-ND; Manufacturer Part Number 1: MMBT2222AWT3G; RoHS: RoHS Compliant; Description 1: TRANS NPN 40V 0.6A SC70-3; Category: Discrete Semiconductor Products; Stock 1: 9990; Pricing 1: 1=0.14, 10=0.126, 100=0.0688, 500=0.04236, 1000=0.02889 (USD); Packaging: Digi-Reel®; Part Status: Active; Operating Temperature: -55°C ~ 150°C (TJ); Package / Case: SC-70, SOT-323; Supplier Device Package: SC-70-3 (SOT323); Transistor Type: NPN; Current - Collector Cutoff (Max): -; Mounting Type: Surface Mount; Base Part Number: MMBT2222A
Q6 = DMG1012UW-7: Manufacturer 1: Diodes Incorporated; Note: Pin 2 is electrically connected to pin 4.; FET Type: N-Channel; Current - Continuous Drain (Id) @ 25°C: 1A (Ta); Drive Voltage (Max Rds On,  Min Rds On): 1.8V, 4.5V; Rds On (Max) @ Id, Vgs: 450 mOhm @ 600mA, 4.5V; Vgs(th) (Max) @ Id: 1V @ 250µA; Vgs (Max): ±6V; Power Dissipation (Max): 290mW (Ta); Published: 8-Jun-2000; LatestRevisionDate: 17-Jul-2002; LatestRevisionNote: Re-released for DXP Platform.; DatasheetVersion: PD-9.814; PackageReference: TO-220AB; Publisher: Altium Limited; Code_JEDEC: TO-220-AB; ComponentLink1Description: Manufacturer Link; ComponentLink1URL: http://www.irf.com/; Digikey P/N: DMG1012UW-7DITR-ND; Supplier 1: Digi-Key; Supplier Part Number 1: DMG1012UW-7DICT-ND; Manufacturer Part Number 1: DMG1012UW-7; RoHS: RoHS Compliant; Description 1: MOSFET N-CH 20V 1A SOT323; Category: Discrete Semiconductor Products; Stock 1: 211076; Pricing 1: 1=0.41, 10=0.37, 100=0.2074, 500=0.1111, 1000=0.07554 (USD); Packaging: Cut Tape (CT); Part Status: Active; Technology: MOSFET (Metal Oxide); FET Feature: -; Operating Temperature: -55°C ~ 150°C (TJ); Mounting Type: Surface Mount; Supplier Device Package: SOT-323; Package / Case: SC-70, SOT-323; ComponentLink2URL: https://www.diodes.com/assets/Datasheets/ds31859.pdf; ComponentLink2Description: https://www.diodes.com/assets/Datasheets/ds31859.pdf
R1 R7-R9 R11 = RC0402FR-0710RL: RES 10.0 OHM 1/16W 1% 0402 SMD; Manufacturer: Yageo; Resistance (Ohms): 10; Power (Watts): 0.063W, 1/16W; .Checked PCB: CHK; Temperature Coefficient: ±200ppm/°C; Category: Resistors; Manufacturer Part Number: RC0402FR-0710RL; Package / Case: 0402 (1005 Metric); Price 1k [$]: 0.01421; Tolerance: ±1%; Value: 10R; .Checked SCH: CHK; Supplier Part Number: 311-10.0LRCT-ND; Supplier: Digikey; Supplier 1: Digi-Key; Supplier Part Number 1: 311-10.0LRCT-ND; RoHS: RoHS Compliant; Stock 1: 681416; Pricing 1: 10=0.014, 50=0.0104, 100=0.0079, 250=0.00584, 500=0.00432, 1000=0.00288 (USD); Composition: Thick Film; Features: -; Size / Dimension: 0.039" L x 0.020" W (1.00mm x 0.50mm); Height: 0.016" (0.40mm); Number of Terminations: 2; Packaging: Cut Tape (CT); ComponentLink1URL: http://www.yageo.com/documents/recent/PYu-RC0402_51_RoHS_L_6.pdf; ComponentLink1Description: http://www.yageo.com/documents/recent/PYu-RC0402_51_RoHS_L_6.pdf
R2 R14-R17 = RC1005J000CS: RES SMD 0 OHM JUMPER 1/16W 0402; Manufacturer 1: Samsung Electro-Mechanics; Power (Watts): 0.063W, 1/16W; .Checked PCB: used; Category: Resistors; Package / Case: 0402 (1005 Metric); Tolerance: Jumper; .Checked SCH: used; Supplier 1: Digi-Key; Supplier Part Number 1: 1276-3480-6-ND; RoHS: RoHS Compliant; Stock 1: 9624698; Pricing 1: 1=0.1, 10=0.016, 25=0.0116, 50=0.009, 100=0.0066, 250=0.005, 500=0.004, 1000=0.00295, 5000=0.00211 (USD); Composition: Thick Film; Features: Moisture Resistant; Temperature Coefficient: -; Size / Dimension: 0.039" L x 0.020" W (1.00mm x 0.50mm); Packaging: Digi-Reel®; ComponentLink1URL: http://www.samsungsem.com/kr/support/product-search/chip-resistor/RC1005J000CS.jsp; ComponentLink1Description: http://www.samsungsem.com/kr/support/product-search/chip-resistor/RC1005J000CS.jsp; Manufacturer Part Number 1: RC1005J000CS; Part Status: Active; Operating Temperature: -55°C ~ 155°C; Supplier Device Package: 0402; Height - Seated (Max): 0.016" (0.40mm); Failure Rate: -; Description 1: RES SMD 0 OHM JUMPER 1/16W 0402
R10 R12 R13 R19-R21 R30 R31 R63-R65 R68 = ERJ-2RKF1001X: RES SMD 1K OHM 1% 1/10W 0402; Manufacturer 1: Panasonic Electronic Components; Power (Watts): 0.1W, 1/10W; .Checked PCB: used; Temperature Coefficient: ±100ppm/°C; Category: Resistors; Package / Case: 0402 (1005 Metric); Tolerance: ±1%; .Checked SCH: used; Supplier 1: Digi-Key; Supplier Part Number 1: P1.00KLDKR-ND; RoHS: RoHS Compliant; Stock 1: 18630560; Pricing 1: 1=0.1, 10=0.056, 100=0.0227, 1000=0.01021, 2500=0.00886, 5000=0.00732 (USD); Composition: Thick Film; Features: Automotive AEC-Q200; Size / Dimension: 0.039" L x 0.020" W (1.00mm x 0.50mm); Packaging: Digi-Reel®; ComponentLink1URL: https://industrial.panasonic.com/cdbs/www-data/pdf/RDA0000/AOA0000C304.pdf; ComponentLink1Description: https://industrial.panasonic.com/cdbs/www-data/pdf/RDA0000/AOA0000C304.pdf; Manufacturer Part Number 1: ERJ-2RKF1001X; Part Status: Active; Operating Temperature: -55°C ~ 155°C; Supplier Device Package: 0402; Height - Seated (Max): 0.016" (0.40mm); Failure Rate: -; Description 1: RES SMD 1K OHM 1% 1/10W 0402
R22 R23 = RC1005F101CS: RES SMD 100 OHM 1% 1/16W 0402; Manufacturer 1: Samsung Electro-Mechanics; Power (Watts): 0.063W, 1/16W; .Checked PCB: RF; Temperature Coefficient: ±100ppm/°C; Category: Resistors; Package / Case: 0402 (1005 Metric); Tolerance: ±1%; value: 100R; .Checked SCH: RF; Supplier 1: Digi-Key; Supplier Part Number 1: 1276-3429-6-ND; RoHS: RoHS Compliant; Stock 1: 461434; Pricing 1: 1=0.1, 10=0.021, 100=0.0087, 1000=0.00391, 2500=0.00339, 5000=0.0028 (USD); Composition: Thick Film; Features: Moisture Resistant; Size / Dimension: 0.039" L x 0.020" W (1.00mm x 0.50mm); Packaging: Digi-Reel®; ComponentLink1URL: http://www.samsungsem.com/kr/support/product-search/chip-resistor/RC1005F101CS.jsp; ComponentLink1Description: http://www.samsungsem.com/kr/support/product-search/chip-resistor/RC1005F101CS.jsp; Manufacturer Part Number 1: RC1005F101CS; Part Status: Active; Operating Temperature: -55°C ~ 155°C; Supplier Device Package: 0402; Height - Seated (Max): 0.016" (0.40mm); Failure Rate: -; Description 1: RES SMD 100 OHM 1% 1/16W 0402
R24 = RMCF0402FT4K99: RES TF 4.99K OHM 1% 1/16W 0402; Manufacturer: Stackpole Electronics Inc; Power (Watts): 0.063W, 1/16W; .Checked PCB: CHK; Temperature Coefficient: ±100ppm/°C; Category: Resistors; Supplier Part Number: RMCF0402FT4K99CT-ND; Manufacturer Part Number: RMCF0402FT4K99; Package / Case: 0402 (1005 Metric); Price 1k [$]: 0.00384; Resistance (Ohms): 4.99K; Tolerance: ±1%; Value: 4k99; .Checked SCH: CHK; Supplier: Digikey; Supplier 1: Digi-Key; Supplier Part Number 1: RMCF0402FT4K99CT-ND; RoHS: RoHS Compliant; Stock 1: 48509; Pricing 1: 1=0.04, 10=0.025, 50=0.0138, 100=0.0105, 250=0.0078, 500=0.00576, 1000=0.00384 (USD); Composition: Thick Film; Features: -; Size / Dimension: 0.039" L x 0.020" W (1.00mm x 0.50mm); Height: 0.016" (0.40mm); Number of Terminations: 2; Packaging: Cut Tape (CT); ComponentLink1URL: http://www.seielect.com/Catalog/SEI-RMCF.pdf; ComponentLink1Description: http://www.seielect.com/Catalog/SEI-RMCF.pdf
R26 = RMCF0402FT365R: RES TF 365 OHM 1% 1/16W 0402; Manufacturer: Stackpole Electronics Inc; Resistance (Ohms): 365; Power (Watts): 0.063W, 1/16W; .Checked PCB: CHK; Temperature Coefficient: ±100ppm/°C; Category: Resistors; Supplier Part Number: RMCF0402FT365RCT-ND; Manufacturer Part Number: RMCF0402FT365R; Package / Case: 0402 (1005 Metric); Price 1k [$]: 0.00384; Tolerance: ±1%; Value: 365R; .Checked SCH: CHK; Supplier: Digikey; Supplier 1: Digi-Key; Supplier Part Number 1: RMCF0402FT365RCT-ND; RoHS: RoHS Compliant; Stock 1: 28385; Pricing 1: 1=0.04, 10=0.025, 50=0.0138, 100=0.0105, 250=0.0078, 500=0.00576, 1000=0.00384 (USD); Composition: Thick Film; Features: -; Size / Dimension: 0.039" L x 0.020" W (1.00mm x 0.50mm); Height: 0.016" (0.40mm); Number of Terminations: 2; Packaging: Cut Tape (CT); ComponentLink1URL: http://www.seielect.com/Catalog/SEI-RMCF.pdf; ComponentLink1Description: http://www.seielect.com/Catalog/SEI-RMCF.pdf
R32 R33 R35 R36 R38 R39 = RMCF0402FT240R: RES TF 240 OHM 1% 0.0625W 0402; Manufacturer: Stackpole Electronics Inc; Resistance (Ohms): 240; Power (Watts): 0.063W, 1/16W; .Checked PCB: CHK; Temperature Coefficient: ±100ppm/°C; Category: Resistors; Supplier Part Number: RMCF0402FT240RCT-ND; Manufacturer Part Number: RMCF0402FT240R; Package / Case: 0402 (1005 Metric); Price 1k [$]: 0.00384; Tolerance: ±1%; Value: 240R; .Checked SCH: CHK; Supplier: Digikey; Supplier 1: Digi-Key; Supplier Part Number 1: RMCF0402FT240RCT-ND; RoHS: RoHS Compliant; Stock 1: 39860; Pricing 1: 1=0.04, 10=0.025, 50=0.0138, 100=0.0105, 250=0.0078, 500=0.00576, 1000=0.00384 (USD); Composition: Thick Film; Features: -; Size / Dimension: 0.039" L x 0.020" W (1.00mm x 0.50mm); Height: 0.016" (0.40mm); Number of Terminations: 2; Packaging: Cut Tape (CT); ComponentLink1URL: http://www.seielect.com/Catalog/SEI-RMCF.pdf; ComponentLink1Description: http://www.seielect.com/Catalog/SEI-RMCF.pdf
R37 = RC0402FR-0747K5L: RES 47.5K OHM 1/16W 1% 0402 SMD; Manufacturer: Yageo; Power (Watts): 0.063W, 1/16W; Temperature Coefficient: ±100ppm/°C; .Checked PCB: CHK; Supplier 1: Digi-Key; Supplier Part Number 1: 311-47.5KLRCT-ND; Manufacturer Part Number: RC0402FR-0747K5L; RoHS: RoHS Compliant; Category: Resistors; Stock 1: 59607; Pricing 1: 10=0.014, 100=0.0063, 500=0.00382, 1000=0.0027, 5000=0.00203 (USD); Resistance (Ohms): 47.5K; Composition: Thick Film; Features: -; Tolerance: ±1%; Package / Case: 0402 (1005 Metric); Size / Dimension: 0.039" L x 0.020" W (1.00mm x 0.50mm); Height: 0.016" (0.40mm); Number of Terminations: 2; Packaging: Cut Tape (CT); ComponentLink1URL: http://www.yageo.com/documents/recent/PYu-RC0402_51_RoHS_L_6.pdf; ComponentLink1Description: http://www.yageo.com/documents/recent/PYu-RC0402_51_RoHS_L_6.pdf; .Checked SCH: CHK
R66 = RL1632R-R120-F: Imported; Vendor: Susumu; Built_By: EMA_UL_Team; C: Copyright (C) 2015 Accelerated Designs. All rights reserved; Tolerance: ±1%; Power (Watts): 0.5W, 1/2W; Temperature Coefficient: 0/ +100ppm/°C; Description 1: RES 0.12 OHM 1% 1/2W 1206; .Checked PCB: CHK; Manufacturer_Part_Number: RL1632R-R120-F; RefDes: RefDes; Type: DEV; Value: Value; Manufacturer 1: Susumu; Manufacturer Part Number 1: RL1632R-R120-F; RoHS: RoHS Compliant; Stock 1: 49813; Pricing 1: 1=0.68, 10=0.485, 25=0.3784, 50=0.3202, 100=0.2523, 250=0.21344, 500=0.17464, 1000=0.13583 (USD); Packaging: Cut Tape (CT); Part Status: Active; Composition: Thin Film; Features: Current Sense; Operating Temperature: -55°C ~ 125°C; Package / Case: 1206 (3216 Metric); Supplier Device Package: 1206; Size / Dimension: 0.126" L x 0.063" W (3.20mm x 1.60mm); Height - Seated (Max): 0.026" (0.65mm); Failure Rate: -; ComponentLink1URL: http://www.susumu.co.jp/common/pdf/n_catalog_partition08_en.pdf; ComponentLink1Description: http://www.susumu.co.jp/common/pdf/n_catalog_partition08_en.pdf; Supplier 1: Digi-Key; Supplier Part Number 1: RL16R.12FCT-ND; Category: Resistors; .Checked SCH: CHK
R69 = RL1632R-R120-F: RES 0.12 OHM 1% 1/2W 1206; Vendor: Susumu; Built_By: EMA_UL_Team; Value: 120; C: Copyright (C) 2015 Accelerated Designs. All rights reserved; Power (Watts): 0.5W, 1/2W; Temperature Coefficient: 0/ +100ppm/°C; .Checked PCB: CHK; Manufacturer_Part_Number: RL1632R-R120-F; RefDes: RefDes; Type: DEV; Manufacturer 1: Susumu; Manufacturer Part Number 1: RL1632R-R120-F; RoHS: RoHS Compliant; Stock 1: 49813; Pricing 1: 1=0.68, 10=0.485, 25=0.3784, 50=0.3202, 100=0.2523, 250=0.21344, 500=0.17464, 1000=0.13583 (USD); Packaging: Cut Tape (CT); Part Status: Active; Tolerance: ±1%; Composition: Thin Film; Features: Current Sense; Operating Temperature: -55°C ~ 125°C; Package / Case: 1206 (3216 Metric); Supplier Device Package: 1206; Size / Dimension: 0.126" L x 0.063" W (3.20mm x 1.60mm); Height - Seated (Max): 0.026" (0.65mm); Failure Rate: -; ComponentLink1URL: http://www.susumu.co.jp/common/pdf/n_catalog_partition08_en.pdf; ComponentLink1Description: http://www.susumu.co.jp/common/pdf/n_catalog_partition08_en.pdf; Supplier 1: Digi-Key; Supplier Part Number 1: RL16R.12FCT-ND; Description 1: RES 0.12 OHM 1% 1/2W 1206; Category: Resistors; .Checked SCH: CHK
U1 = SN65HVD1050DR: IC EMC CAN TRANSCEIVER 8-SOIC; Manufacturer: Texas Instruments; Built_By: EMA_UL_Team; C: Copyright (C) 2015 Accelerated Designs. All rights reserved; Protocol: CANbus; Number of Drivers/Receivers: 1/1; Duplex: Half; Voltage - Supply: 4.5 V ~ 5.5 V; .Checked PCB: CHK; Vendor: Texas Instruments; Manufacturer_Part_Number: SN65HVD1050DR; RefDes: RefDes; Type: DEV; Value: Value; Manufacturer 1: Texas Instruments; Manufacturer Part Number 1: SN65HVD1050DR; RoHS: RoHS Compliant; Stock 1: 82774; Pricing 1: 1=1.36, 10=1.215, 100=0.9476, 500=0.7828, 1000=0.618 (USD); Packaging: Cut Tape (CT); Part Status: Active; Data Rate: -; Operating Temperature: -40°C ~ 125°C; Mounting Type: Surface Mount; Package / Case: 8-SOIC (0.154", 3.90mm Width); Supplier Device Package: 8-SOIC; Base Part Number: SN65HVD1050; ComponentLink1URL: http://www.ti.com/lit/ds/symlink/sn65hvd1050.pdf; ComponentLink1Description: http://www.ti.com/lit/ds/symlink/sn65hvd1050.pdf; Supplier 1: Digi-Key; Supplier Part Number 1: 296-26335-1-ND; Description 1: IC EMC CAN TRANSCEIVER 8-SOIC; Category: Integrated Circuits (ICs); .Checked SCH: CHK
U2 U3 U5 U25 U26 = LTV-817S-TA1: OPTOISOLATR 5KV TRANSISTOR 4-SMD; Manufacturer 1: Lite-On Inc.; Voltage - Isolation: 5000Vrms; Current Transfer Ratio (Min): 50% @ 5mA; Current Transfer Ratio (Max): 600% @ 5mA; Rise / Fall Time (Typ): 4µs, 3µs; Input Type: DC; Voltage - Output (Max): 35V; Current - Output / Channel: 50mA; Voltage - Forward (Vf) (Typ): 1.2V; Vce Saturation (Max): 200mV; Supplier 1: Digi-Key; Supplier Part Number 1: 160-1893-6-ND; Manufacturer Part Number 1: LTV-817S-TA1; RoHS: RoHS Compliant; Description 1: OPTOISOLATR 5KV TRANSISTOR 4-SMD; Category: Isolators; Stock 1: 191196; Pricing 1: 1=0.51, 10=0.369, 25=0.3016, 100=0.2411, 250=0.20344, 500=0.1733 (USD); Packaging: Digi-Reel®; Part Status: Active; Turn On / Turn Off Time (Typ): -; Output Type: Transistor; Operating Temperature: -30°C ~ 110°C; Mounting Type: Surface Mount; Package / Case: 4-SMD, Gull Wing; Supplier Device Package: 4-SMD; ComponentLink1URL: http://optoelectronics.liteon.com/upload/download/DS-70-96-0016/LTV-8X7%20series%20201610%20.pdf; ComponentLink1Description: http://optoelectronics.liteon.com/upload/download/DS-70-96-0016/LTV-8X7%20series%20201610%20.pdf
U4 = CRE1S0505SC: DC/DC TH 1W 5-5V SIP SINGLE; Manufacturer 1: Murata Power Solutions Inc.; Voltage - Input (Min): 4.5V; Voltage - Input (Max): 5.5V; Voltage - Output 1: 5V; Current - Output (Max): 200mA; Efficiency: 70%; .Checked SCH: CHK; Manufacturer Part Number 1: CRE1S0505SC; RoHS: RoHS Compliant; Stock 1: 676; Pricing 1: 1=2.69, 5=2.68, 10=2.66, 25=2.63, 50=2.56, 100=2.43, 250=2.28, 500=2.13002, 1000=2.1147 (USD); Packaging: Tube; Part Status: Active; Type: Isolated Module; Voltage - Output 2: -; Voltage - Output 3: -; Applications: ITE (Commercial); Features: -; Operating Temperature: -40°C ~ 85°C; Mounting Type: Through Hole; Package / Case: 4-SIP Module; Size / Dimension: 0.45" L x 0.24" W x 0.30" H (11.5mm x 6.1mm x 7.5mm); Supplier Device Package: -; ComponentLink1URL: https://power.murata.com/data/power/ncl/kdc_cre1.pdf; ComponentLink1Description: https://power.murata.com/data/power/ncl/kdc_cre1.pdf; Supplier 1: Digi-Key; Supplier Part Number 1: 811-3196-ND; Description 1: DC/DC TH 1W 5-5V SIP SINGLE; Category: Power Supplies - Board Mount; .Checked PCB: CHK
U23 = MAX3207EAUT+T: MAX3207E; Manufacturer 1: Maxim Integrated; Vendor: Maxim Integrated Products; Built_By: EMA_UL_Team; C: Copyright (C) 2015 Accelerated Designs. All rights reserved; Power Line Protection: Yes; Description 1: TVS DIODE SOT23-6; .Checked PCB: CHK; Manufacturer_Part_Number: MAX3207EAUT+T; RefDes: RefDes; Type: DEV; Value: Value; Manufacturer Part Number 1: MAX3207EAUT+T; RoHS: RoHS Compliant; Stock 1: 8902; Pricing 1: 1=1.3, 10=1.224, 25=0.9792, 50=0.9302, 100=0.8568, 250=0.81276, 500=0.78336 (USD); Packaging: Cut Tape (CT); Part Status: Active; Voltage - Reverse Standoff (Typ): -; Voltage - Breakdown (Min): -; Voltage - Clamping (Max) @ Ipp: -; Current - Peak Pulse (10/1000µs): -; Power - Peak Pulse: -; Applications: USB OTG; Capacitance @ Frequency: -; Operating Temperature: -40°C ~ 125°C (TA); Mounting Type: Surface Mount; Package / Case: SOT-23-6; Supplier Device Package: SOT-23-6; Base Part Number: MAX3207E; ComponentLink1URL: https://datasheets.maximintegrated.com/en/ds/MAX3205E-MAX3208E.pdf; ComponentLink1Description: https://datasheets.maximintegrated.com/en/ds/MAX3205E-MAX3208E.pdf; Supplier 1: Digi-Key; Supplier Part Number 1: MAX3207EAUT+TCT-ND; Category: Circuit Protection; .Checked SCH: CHK
U24 = MAX490: IC TXRX RS485/RS422 8-SOIC; Manufacturer 1: Maxim Integrated; .Checked PCB: CHK; Function: Transceiver; Data Rate: 2.5 Mb/s; Number of Drivers: 1 Driver; Number of Receivers: 1 Receiver; Operating Supply Voltage: 5 V; Operating Supply Current: 300 uA; Duplex: Full Duplex; Input Voltage: 0.8 V to 2 V; Output Voltage: 3 V; Pd - Power Dissipation: 471 mW; Propagation Delay Time: 40 ns, 60 ns; Unit Weight: 0.019048 oz; .Checked SCH: CHK; Supplier 1: RSComponents; Supplier Part Number 1: 7327955; Manufacturer Part Number 1: MAX490ECSA+; Description 1: IC TXRX RS485/RS422 8-SOIC; Stock 1: 37; Pricing 1: 1=2.67, 25=2.59, 100=2.53, 250=2.46, 500=2.4 (EUR); Product Category: RS-422/RS-485 Interface IC; RoHS: True; Maximum Operating Temperature: + 70 C; Minimum Operating Temperature: 0 C; Mounting Style: SMD/SMT; Package / Case: SOIC-8; Packaging: Tube; Brand: Maxim Integrated; Series: MAX490E; Part # Aliases: MAX490E; ComponentLink1URL: https://datasheet.ciiva.com/26835/max490ecsa-26835125.pdf; ComponentLink1Description: https://datasheet.ciiva.com/26835/max490ecsa-26835125.pdf; ComponentLink2URL: https://datasheet.ciiva.com/4786/max1487e-max491e-101921-4786102.pdf; ComponentLink2Description: https://datasheet.ciiva.com/4786/max1487e-max491e-101921-4786102.pdf; ComponentLink3URL: https://datasheet.ciiva.com/1713/max1487e-max491e-1713224.pdf; ComponentLink3Description: https://datasheet.ciiva.com/1713/max1487e-max491e-1713224.pdf; ComponentLink4URL: https://datasheet.ciiva.com/14152/max481e-83e-1487e-eng-tds-14152666.pdf; ComponentLink4Description: https://datasheet.ciiva.com/14152/max481e-83e-1487e-eng-tds-14152666.pdf; ComponentLink5URL: https://datasheet.ciiva.com/16641/max1487e-max491e-16641645.pdf; ComponentLink5Description: https://datasheet.ciiva.com/16641/max1487e-max491e-16641645.pdf; ComponentLink6URL: https://datasheet.ciiva.com/3028/max1487e-max491e-3028671.pdf; ComponentLink6Description: https://datasheet.ciiva.com/3028/max1487e-max491e-3028671.pdf
U?#1 = ST3222: ST Dual RS232 Transceiver; Manufacturer 1: STMicroelectronics; Manufacturer Part Number 1: ST3222BTR; .Checked PCB: CHK; Description 1: IC DRIVER/RCVR RS232 LP 20-TSSOP; Number of Drivers/Receivers: 2/2; Duplex: Full; Data Rate: 250kbps; Voltage - Supply: 3 V ~ 3.6 V; Digikey P/N: 497-5845-2-ND; .Checked SCH: CHK; Supplier 1: Digi-Key; RoHS: RoHS Compliant; Category: Integrated Circuits (ICs); Stock 1: 3064; Pricing 1: 1=1.32, 10=1.183, 100=0.9225, 500=0.76206, 1000=0.60162 (USD); Packaging: Digi-Reel®; Part Status: Active; Type: Transceiver; Protocol: RS232; Operating Temperature: -40°C ~ 85°C; Mounting Type: Surface Mount; Package / Case: 20-TSSOP (0.173", 4.40mm Width); Supplier Device Package: 20-TSSOP; Base Part Number: ST3222; ComponentLink1URL: http://www.st.com/content/ccc/resource/technical/document/datasheet/a7/2a/91/f8/35/8c/40/de/CD00002292.pdf/files/CD00002292.pdf/jcr:content/translations/en.CD00002292.pdf; ComponentLink1Description: http://www.st.com/content/ccc/resource/technical/document/datasheet/a7/2a/91/f8/35/8c/40/de/CD00002292.pdf/files/CD00002292.pdf/jcr:content/translations/en.CD00002292.pdf
U?#2 = ST3222: ST Dual RS232 Transceiver; Manufacturer: STMicroelectronics; Manufacturer Part Number: ST3222BTR; Number of Drivers/Receivers: 2/2; Duplex: Full; Data Rate: 250kbps; Voltage - Supply: 3 V ~ 3.6 V; .Checked PCB: CHK; Description 2: IC DRIVER/RCVR RS232 LP 20-TSSOP; Digikey P/N: 497-5845-2-ND; Supplier 1: Digi-Key; RoHS: RoHS Compliant; Category: Integrated Circuits (ICs); Stock 1: 3074; Pricing 1: 1=1.32, 10=1.183, 100=0.9225, 500=0.76206, 1000=0.60162 (USD); Packaging: Cut Tape (CT); Part Status: Active; Type: Transceiver; Protocol: RS232; Operating Temperature: -40°C ~ 85°C; Mounting Type: Surface Mount; Package / Case: 20-TSSOP (0.173", 4.40mm Width); Supplier Device Package: 20-TSSOP; Base Part Number: ST3222; ComponentLink1URL: http://www.st.com/content/ccc/resource/technical/document/datasheet/a7/2a/91/f8/35/8c/40/de/CD00002292.pdf/files/CD00002292.pdf/jcr:content/translations/en.CD00002292.pdf; ComponentLink1Description: http://www.st.com/content/ccc/resource/technical/document/datasheet/a7/2a/91/f8/35/8c/40/de/CD00002292.pdf/files/CD00002292.pdf/jcr:content/translations/en.CD00002292.pdf; Supplier Part Number 1: 497-5845-1-ND; .Checked SCH: CHK; Supplier 2: Digi-Key; Supplier Part Number 2: 497-5845-6-ND; Manufacturer 2: STMicroelectronics; Manufacturer Part Number 2: ST3222BTR; Stock 2: 3064; Pricing 2: 1=1.32, 10=1.183, 100=0.9225, 500=0.76206, 1000=0.60162 (USD)
U?#3 = ST3222: ST Dual RS232 Transceiver; Manufacturer: STMicroelectronics; Number of Drivers/Receivers: 2/2; Duplex: Full; Data Rate: 250kbps; Voltage - Supply: 3 V ~ 3.6 V; .Checked SCH: CHK; Digikey P/N: 497-5845-2-ND; Supplier 1: Digi-Key; Manufacturer Part Number: ST3222BTR; RoHS: RoHS Compliant; Category: Integrated Circuits (ICs); Stock 1: 3074; Pricing 1: 1=1.32, 10=1.183, 100=0.9225, 500=0.76206, 1000=0.60162 (USD); Packaging: Cut Tape (CT); Part Status: Active; Type: Transceiver; Protocol: RS232; Operating Temperature: -40°C ~ 85°C; Mounting Type: Surface Mount; Package / Case: 20-TSSOP (0.173", 4.40mm Width); Supplier Device Package: 20-TSSOP; Base Part Number: ST3222; ComponentLink1URL: http://www.st.com/content/ccc/resource/technical/document/datasheet/a7/2a/91/f8/35/8c/40/de/CD00002292.pdf/files/CD00002292.pdf/jcr:content/translations/en.CD00002292.pdf; ComponentLink1Description: http://www.st.com/content/ccc/resource/technical/document/datasheet/a7/2a/91/f8/35/8c/40/de/CD00002292.pdf/files/CD00002292.pdf/jcr:content/translations/en.CD00002292.pdf; Supplier Part Number 1: 497-5845-1-ND